# Altium schematic sheet Main.SchDoc
size A; SheetNumber: 1; SheetTotal: 4
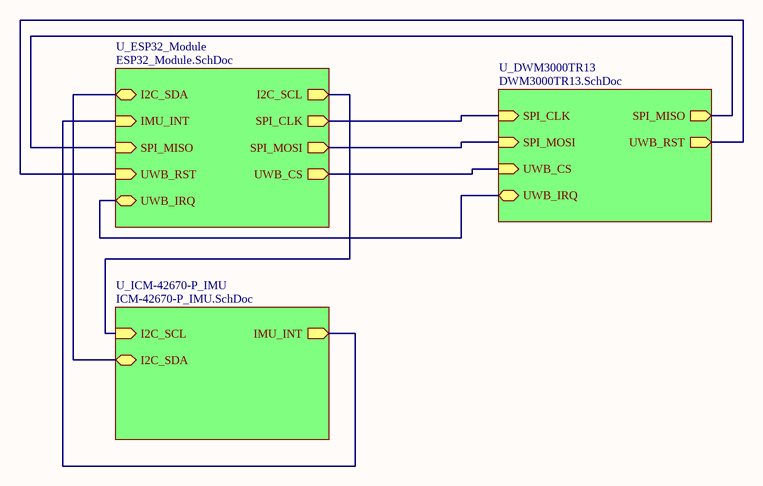
[diagram p0: Main.SchDoc]

## Sub-sheets
U_DWM3000TR13 = DWM3000TR13.SchDoc: SPI_CLK (in), SPI_MISO (out), SPI_MOSI (in), UWB_CS (in), UWB_RST (out), UWB_IRQ (bidir)
U_ESP32_Module = ESP32_Module.SchDoc: I2C_SCL (out), I2C_SDA (bidir), IMU_INT (in), SPI_CLK (out), SPI_MISO (in), SPI_MOSI (out), UWB_CS (out), UWB_RST (in), UWB_IRQ (bidir)
U_ICM-42670-P_IMU = ICM-42670-P_IMU.SchDoc: I2C_SCL (in), I2C_SDA (bidir), IMU_INT (out)

## Nets
(unnamed): sheet U_ESP32_Module/I2C_SCL, sheet U_ICM-42670-P_IMU/I2C_SCL
(unnamed): sheet U_ESP32_Module/I2C_SDA, sheet U_ICM-42670-P_IMU/I2C_SDA
(unnamed): sheet U_ESP32_Module/IMU_INT, sheet U_ICM-42670-P_IMU/IMU_INT
(unnamed): sheet U_ESP32_Module/SPI_CLK, sheet U_DWM3000TR13/SPI_CLK
(unnamed): sheet U_ESP32_Module/SPI_MISO, sheet U_DWM3000TR13/SPI_MISO
(unnamed): sheet U_ESP32_Module/SPI_MOSI, sheet U_DWM3000TR13/SPI_MOSI
(unnamed): sheet U_ESP32_Module/UWB_CS, sheet U_DWM3000TR13/UWB_CS
(unnamed): sheet U_ESP32_Module/UWB_RST, sheet U_DWM3000TR13/UWB_RST
(unnamed): sheet U_ESP32_Module/UWB_IRQ, sheet U_DWM3000TR13/UWB_IRQ